# EAGLE design SunriseClockMainv2 (EAGLE 7.6.0)
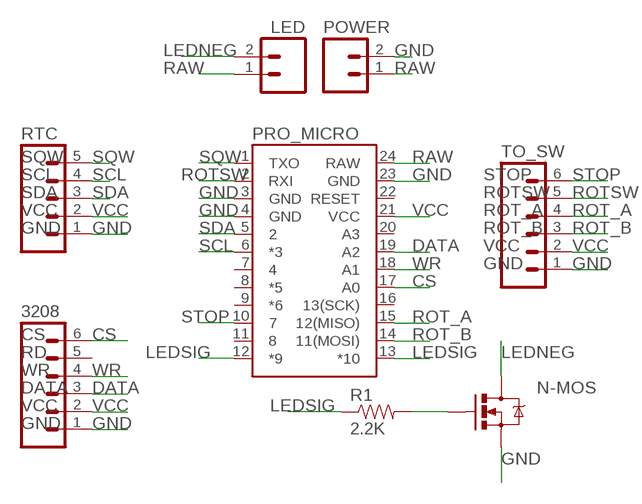
[diagram p0: schematic, sheet 1]

## Parts
3208  M06LOCK  [1X06_LOCK]
LED  M02LOCK  [1X02_LOCK]
N-MOS  MOSFET-NCHANNELFQP30N06L  [TO220V]
POWER  M025MM  [SCREWTERMINAL-5MM-2]
PRO_MICRO  ARDUINO_PRO_MICRO  [ARDUINO_PRO_MICRO]
R1  2.2K  RESISTORPTH-1/4W  [AXIAL-0.4]
RTC  M05LOCK  [1X05_LOCK]
TO_SW  M06LOCK  [1X06_LOCK]

## Nets
CS: 3208.6 PRO_MICRO.17(A0)
DATA: 3208.3 PRO_MICRO.19(A2)
GND: 3208.1 N-MOS.3(S) POWER.2 PRO_MICRO.3(GND) PRO_MICRO.4(GND) PRO_MICRO.23(GND) RTC.1 TO_SW.1
LEDNEG: LED.2 N-MOS.2(D)
LEDSIG: PRO_MICRO.12(*9) PRO_MICRO.13(*10) R1.P$1
N$1: N-MOS.1(G) R1.P$2
RAW: LED.1 POWER.1 PRO_MICRO.24(RAW)
ROT_A: PRO_MICRO.15(12(MISO)) TO_SW.4
ROT_B: PRO_MICRO.14(11(MOSI)) TO_SW.3
ROTSW: PRO_MICRO.2(RXI) TO_SW.5
SCL: PRO_MICRO.6(*3) RTC.4
SDA: PRO_MICRO.5 RTC.3
SQW: PRO_MICRO.1(TXO) RTC.5
STOP: PRO_MICRO.10 TO_SW.6
VCC: 3208.2 PRO_MICRO.21(VCC) RTC.2 TO_SW.2
WR: 3208.4 PRO_MICRO.18(A1)
Unconnected: 3208.5 PRO_MICRO.7 PRO_MICRO.8(*5) PRO_MICRO.9(*6) PRO_MICRO.11 PRO_MICRO.16(13(SCK)) PRO_MICRO.20(A3) PRO_MICRO.22(RESET)

## Library data of the parts
3208 TO_SW = SparkFun-Connectors:M06: Header 6 Standard 6-pin 0.1" header. Use with straight break away headers (SKU : PRT-00116), right angle break away headers (PRT-00553), swiss pins (PRT-00743), machine pins (PRT-00117), and female headers (PRT-00115). Molex polarized connector foot print use with SKU : PRT-08094 with associated crimp pins and housings. NOTES ON THE VARIANTS LOCK and LOCK_LONGPADS... This footprint was designed to help hold the alignment of a through-hole component (i.e. 6-pin header) while soldering it into place. You may notice that each hole has been shifted either up or down by 0.005 of an inch from it's more standard position (which is a perfectly straight line). This slight alteration caused the pins (the squares in the middle) to touch the edges of the holes. Because they are alternating, it causes a "brace" to hold the component in place. 0.005 has proven to be the perfect amount of "off-center" position when using our standard breakaway headers. Although looks a little odd when you look at the bare footprint, once you have a header in there, the alteration is very hard to notice. Also,if you push a header all the way into place, it is covered up entirely on the bottom side. This idea of altering the position of holes to aid alignment will be further integrated into the Sparkfun Library for other footprints. It can help hold any component with 3 or more connection pins.
LED = SparkFun-Connectors:M02: Standard 2-pin 0.1" header. Use with - straight break away headers ( PRT-00116) - right angle break away headers (PRT-00553) - swiss pins (PRT-00743) - machine pins (PRT-00117) - female headers (PRT-00115) Molex polarized connector foot print use with: PRT-08233 with associated crimp pins and housings. 2.54_SCREWTERM for use with PRT-10571. 3.5mm Screw Terminal footprints for PRT-08084 5mm Screw Terminal footprints for use with PRT-08432
N-MOS = SparkFun-DiscreteSemi:MOSFET-NCHANNEL: Common NMOSFET Parts MFG P/N Store ID Prod ID FDD8780 TRANS-09984 SI7820DN TRANS-11055 FDS6630A IC-08089 2N7002PW TRANS-11151 FQP30N06L COM-10213 TRANS-10060 BSS123LT1G TRANS-08345 BSS138 TRANS-00830 BS170 2N7000; PROD_ID: TRANS-10060
POWER = SparkFun-Connectors:M02: Standard 2-pin 0.1" header. Use with - straight break away headers ( PRT-00116) - right angle break away headers (PRT-00553) - swiss pins (PRT-00743) - machine pins (PRT-00117) - female headers (PRT-00115) Molex polarized connector foot print use with: PRT-08233 with associated crimp pins and housings. 2.54_SCREWTERM for use with PRT-10571. 3.5mm Screw Terminal footprints for PRT-08084 5mm Screw Terminal footprints for use with PRT-08432; STOREFRONT_ID: PRT-08432
PRO_MICRO = SparkFun-Boards:ARDUINO_PRO_MICRO
R1 = SparkFun-Resistors:RESISTOR: Resistor Basic schematic elements and footprints for 0603, 1206, and PTH resistors.
RTC = SparkFun-Connectors:M05: Header 5 Standard 5-pin 0.1" header. Use with straight break away headers (SKU : PRT-00116), right angle break away headers (PRT-00553), swiss pins (PRT-00743), machine pins (PRT-00117), and female headers (PRT-00115). Molex polarized connector foot print use with SKU : PRT-08230 with associated crimp pins and housings.; GND: 1; SCL: 4; SDA: 3; SQW: 5; VCC: 2

## Board
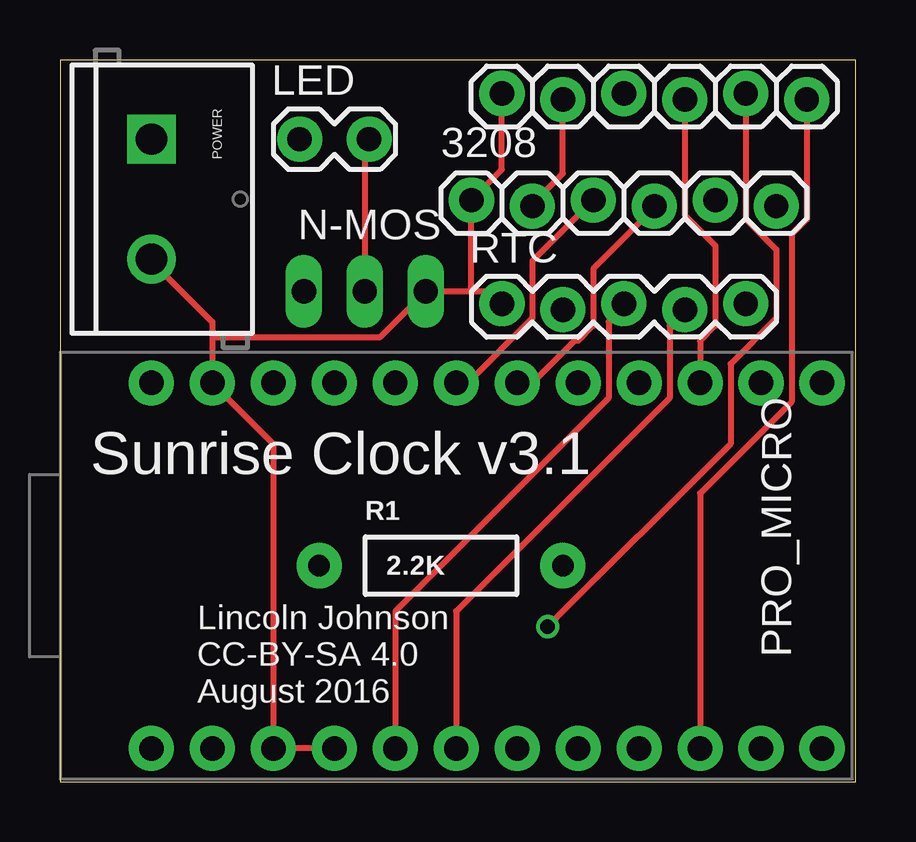
[diagram p1: board, top side]
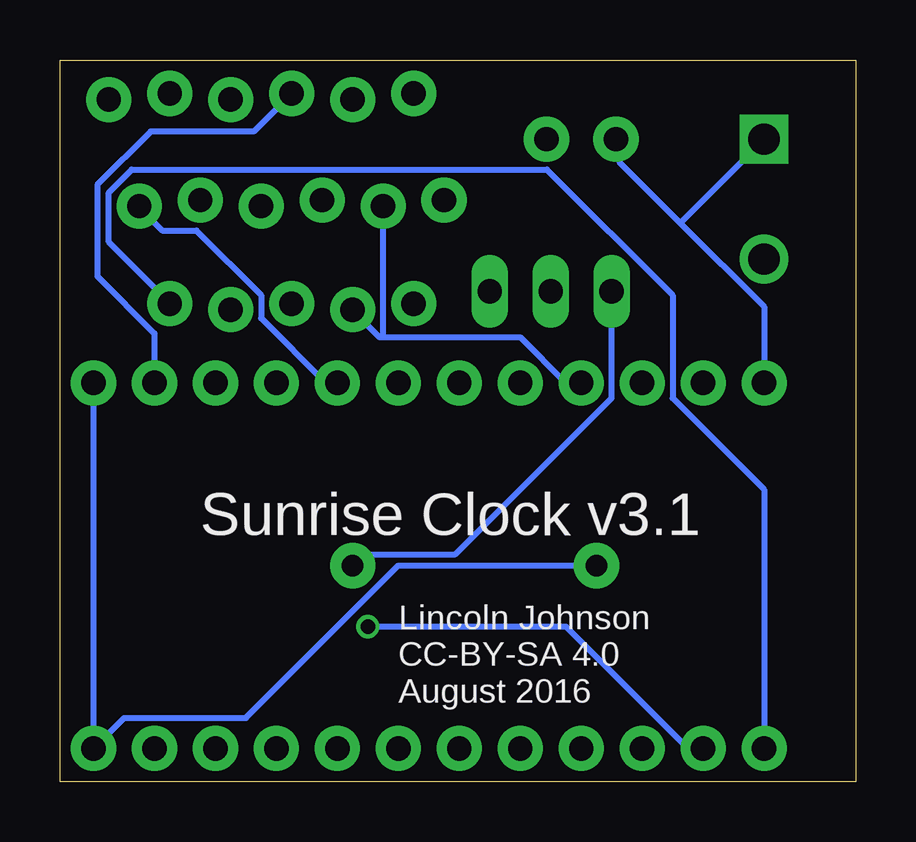
[diagram p2: board, bottom side, seen from below]

Size 33.15 x 30.1 mm. Coordinates in mm from the lower left corner, seen from the top.
Outline: 0,0 33.15,0 33.15,30.1 0,30.1 0,0
Copper layers (1*16): Top 0.0356mm / dielectric 1.5011mm / Bottom 0.0356mm
Design rules "oshpark-2layer": minimum track width 6mil, minimum drill 13mil, track to track 6mil, track to pad 6mil, pad to pad 6mil, via to via 6mil, smd to smd 6mil, copper to edge 15mil, drill to drill 6mil, minimum pad ring 7mil, minimum via ring 7mil, stop-mask expansion 2.5mil, vias tented up to drill 0mil, thermal gap 10mil

### Footprints (pad centres in the part's own frame; a part is rotated, then mirrored left to right if it is on the bottom)
1X06_LOCK = drill 1.016 pad 1.88: 1 0,0; 2 2.54,-0.254; 3 5.08,0; 4 7.62,-0.254; 5 10.16,0; 6 12.7,-0.254
1X02_LOCK = drill 1.016 pad 1.88: 1 -0.178,0; 2 2.718,0
TO220V = drill 1.016 long: 1 -2.54,0; 2 0,0; 3 2.54,0
SCREWTERMINAL-5MM-2 = drill 1.3 pad 2.032 square: 1 0,0 | drill 1.3 pad 2.032: 2 5,0
ARDUINO_PRO_MICRO = drill 1.016 pad 1.88: 1 -7.62,12.7; 2 -7.62,10.16; 3 -7.62,7.62; 4 -7.62,5.08; 5 -7.62,2.54; 6 -7.62,0; 7 -7.62,-2.54; 8 -7.62,-5.08; 9 -7.62,-7.62; 10 -7.62,-10.16; 11 -7.62,-12.7; 12 -7.62,-15.24; 13 7.62,-15.24; 14 7.62,-12.7; 15 7.62,-10.16; 16 7.62,-7.62; 17 7.62,-5.08; 18 7.62,-2.54; 19 7.62,0; 20 7.62,2.54; 21 7.62,5.08; 22 7.62,7.62; 23 7.62,10.16; 24 7.62,12.7
AXIAL-0.4 = drill 0.9 pad 1.88: P$1 -5.08,0; P$2 5.08,0
1X05_LOCK = drill 1.016 pad 1.88: 1 0,0.127; 2 2.54,-0.127; 3 5.08,0.127; 4 7.62,-0.127; 5 10.16,0.127

### Placement (x,y rotation side)
3208  17.14,24.26 0 top
LED  10.16,26.8 0 top
N-MOS  12.7,20.45 0 top
POWER  3.81,26.8 270 top
PRO_MICRO  16.51,9.02 90 top
R1  15.88,9.02 0 top
RTC  18.41,19.81 0 top
TO_SW  18.41,28.7 0 top

### Tracks (layer width: path | path; a pad name or v marks a point on that pad's centre or on a via)
CS
  Bottom 0.254: PRO_MICRO.17 22.07,16.64 24.77,19.34 24.77,20.29 27.46,22.99 28.89,22.99 29.84,23.94 3208.6
DATA
  Top 0.254: PRO_MICRO.19 16.99,16.64 19.68,19.34 19.68,21.72 3208.3
GND
  Top 0.254: 17.14,20.45 17.94,20.45 18.41,19.97 RTC.1 | 17.14,20.45 N-MOS.3 13.34,18.54 6.35,18.54 | 17.14,20.45 3208.1 18.41,25.53 TO_SW.1 | PRO_MICRO.4 PRO_MICRO.3 8.89,14.1 PRO_MICRO.23 6.35,18.54 | 6.35,18.54 6.35,19.18 3.81,21.72 POWER.2
LEDNEG
  Top 0.254: N-MOS.2 12.7,26.64 12.86,26.8 LED.2
LEDSIG
  Bottom 0.254: R1.P$1 19.05,9.02 25.4,2.67 30.48,2.67 PRO_MICRO.12 PRO_MICRO.13
N$1
  Bottom 0.254: N-MOS.1 10.16,16 16.67,9.49 20.48,9.49 R1.P$2
RAW
  Bottom 0.254: PRO_MICRO.24 3.81,19.81 7.3,23.3 | 7.3,23.3 9.84,25.84 9.84,26.8 LED.1 | 7.3,23.3 POWER.1
ROT_A
  Top 0.254: PRO_MICRO.15 26.67,18.38 27.3,19.02 27.3,22.35 26.04,23.62 TO_SW.4
ROT_B
  Bottom 0.254: PRO_MICRO.14 29.21,18.7 31.59,21.08 31.59,24.89 29.37,27.12 25.08,27.12 TO_SW.3
ROTSW  (via drill 0.61)
  Top 0.254: v20.32,6.48 27.94,14.1 27.94,17.43 29.84,19.34 29.84,22.19 28.57,23.46 TO_SW.5
  Bottom 0.254: PRO_MICRO.2 6.99,1.4 12.06,6.48 v20.32,6.48
SCL
  Top 0.254: PRO_MICRO.6 16.51,7.11 25.4,16 25.4,19.02 26.04,19.65 RTC.4
SDA
  Top 0.254: PRO_MICRO.5 13.97,7.11 22.86,16 22.86,19.18 23.5,19.81 RTC.3
SQW
  Bottom 0.254: PRO_MICRO.1 3.81,12.19 7.62,16 7.62,20.29 12.86,25.53 30.16,25.53 31.11,24.57 31.11,22.51 28.57,19.97 RTC.5
STOP
  Top 0.254: PRO_MICRO.10 26.67,12.03 30.48,15.84 30.48,22.83 31.11,23.46 TO_SW.6
VCC
  Top 0.254: TO_SW.2 20.95,25.37 19.68,24.1 3208.2
  Bottom 0.254: PRO_MICRO.21 12.06,16.64 13.97,18.54 19.68,18.54 | 19.68,18.54 19.84,18.54 20.95,19.65 RTC.2 | 19.68,18.54 3208.2
WR
  Top 0.254: PRO_MICRO.18 19.68,16.64 21.43,18.38 21.59,18.38 22.23,19.02 22.23,21.4 24.77,23.94 3208.4

### Text on the board
tPlace: Sunrise Clock v3.1 | Lincoln Johnson / CC-BY-SA 4.0 / August 2016
bPlace: Sunrise Clock v3.1 | Lincoln Johnson / CC-BY-SA 4.0 / August 2016